# EAGLE schematic Tracker_V1 (EAGLE 9.6.2)
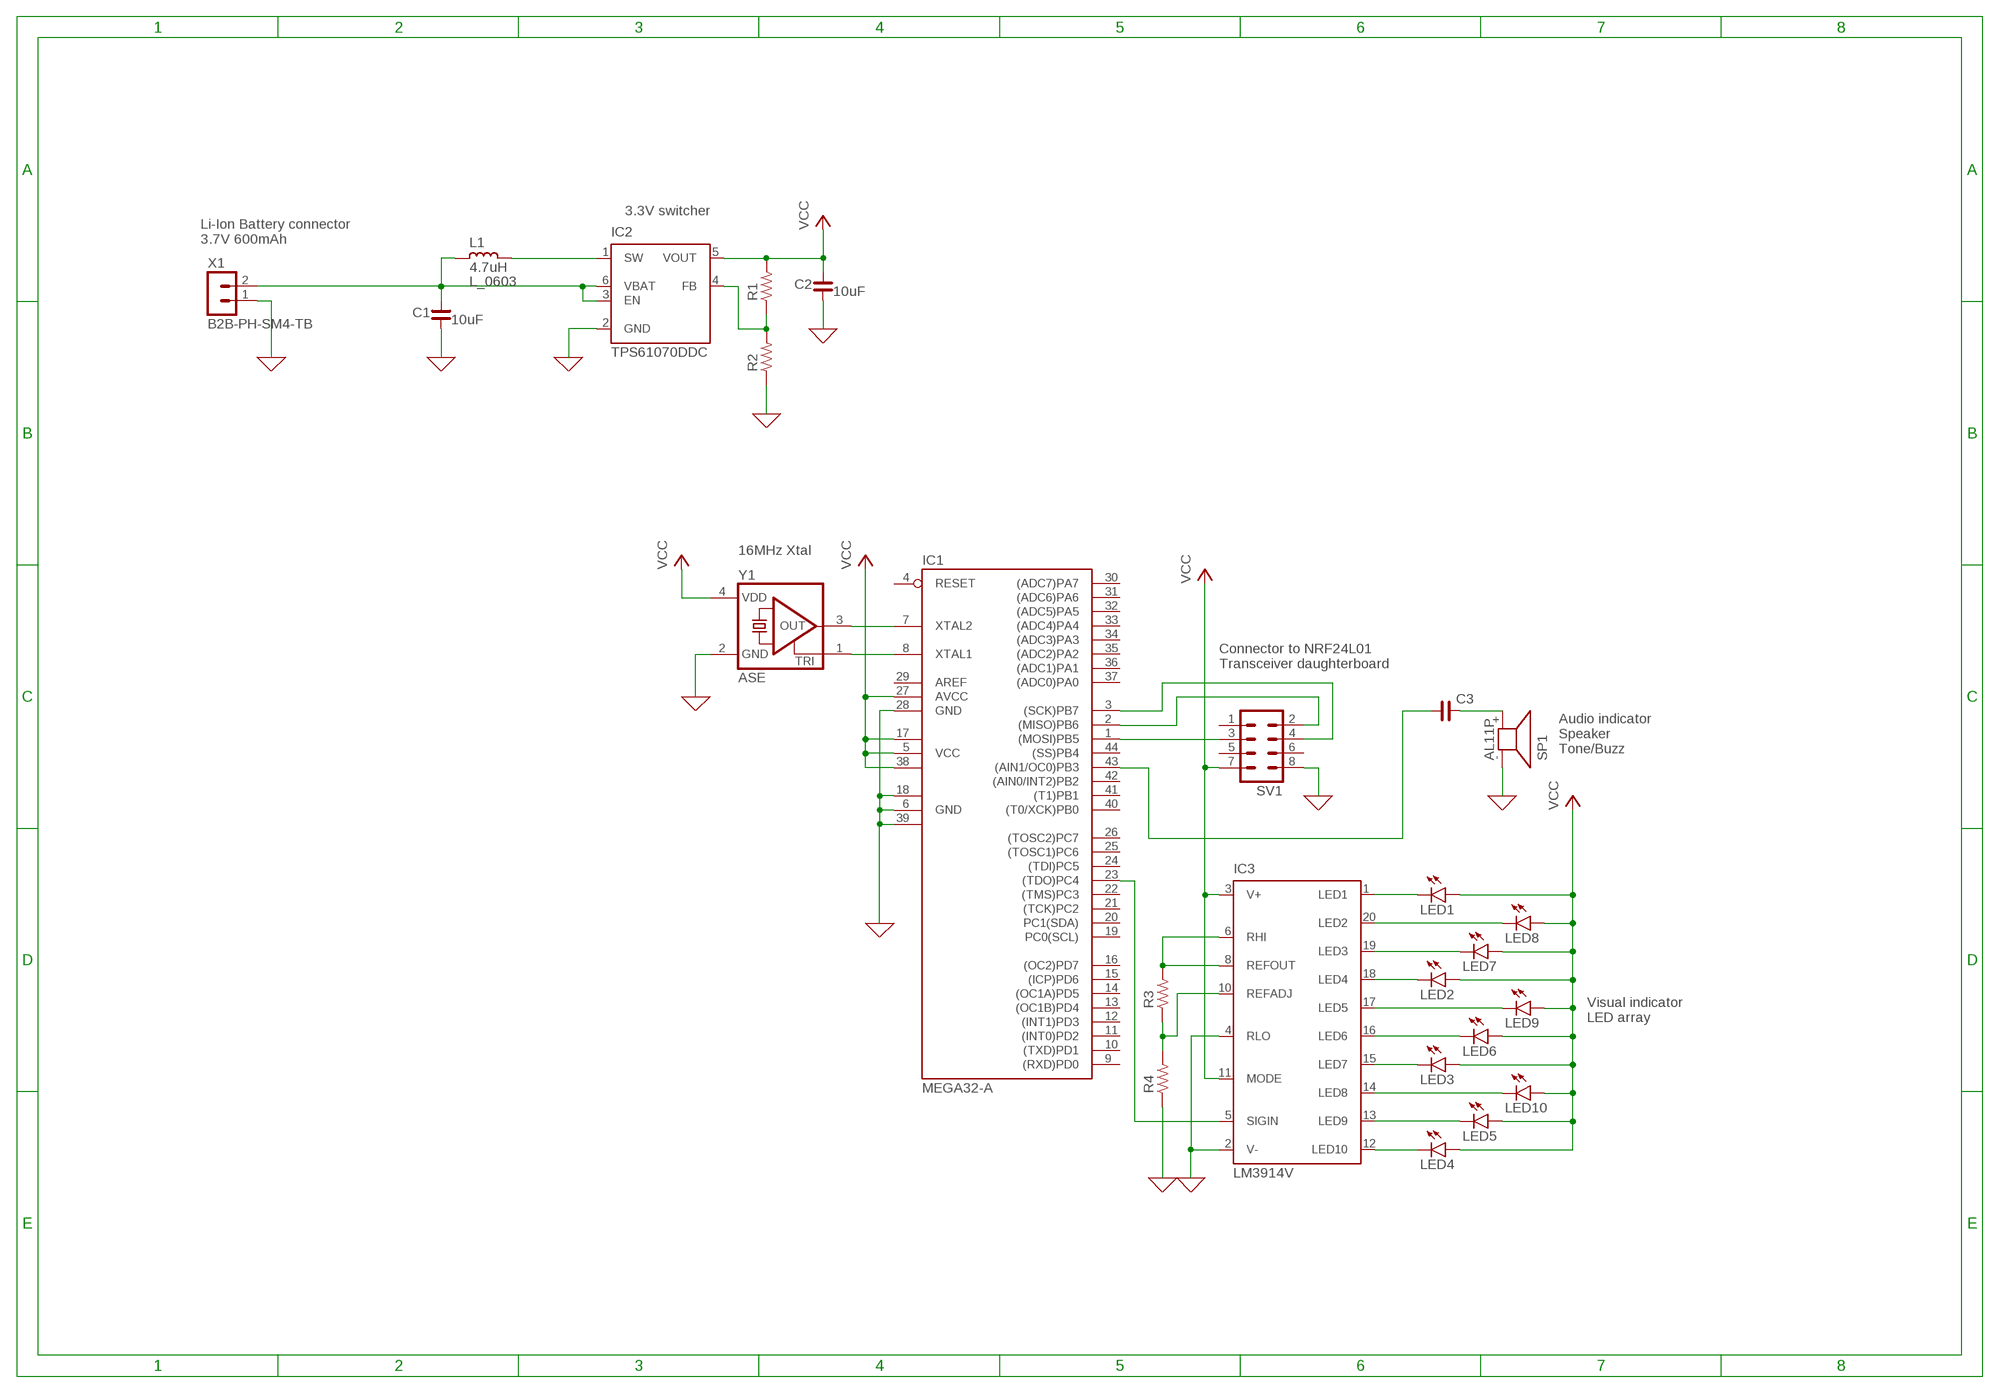
[diagram p0: schematic, sheet 1]

## Parts
C1  C_0603  [C0603]
C2  C_0603  [C0603]
C3  C_0603  [C0603]
IC1  MEGA32-A  [TQFP44]
IC2  TPS61070DDC  [TSOT23-6_DDC]
IC3  LM3914V  [PLCC20S]
L1  L_0603  [L0603]
LED1  LEDCHIP-LED0603  [CHIP-LED0603]
LED2  LEDCHIP-LED0603  [CHIP-LED0603]
LED3  LEDCHIP-LED0603  [CHIP-LED0603]
LED4  LEDCHIP-LED0603  [CHIP-LED0603]
LED5  LEDCHIP-LED0603  [CHIP-LED0603]
LED6  LEDCHIP-LED0603  [CHIP-LED0603]
LED7  LEDCHIP-LED0603  [CHIP-LED0603]
LED8  LEDCHIP-LED0603  [CHIP-LED0603]
LED9  LEDCHIP-LED0603  [CHIP-LED0603]
LED10  LEDCHIP-LED0603  [CHIP-LED0603]
R1  R_0603  [R0603]
R2  R_0603  [R0603]
R3  R_0603  [R0603]
R4  R_0603  [R0603]
SP1  AL11P  [AL11P]
SV1  MA04-2  [MA04-2]
X1  B2B-PH-SM4-TB  [B2B-PH-SM4-TB]
Y1  ASE  [ASE]

## Nets
0: C1.1 C2.1 IC1.6(GND) IC1.18(GND1) IC1.28(GND) IC1.39(GND2) IC2.2(GND) IC3.2(V-) IC3.4(RLO) R2.1 R4.1 SP1.- SV1.8 X1.1 Y1.2(GND) ; supply symbol labelled GND
N$1: IC2.1(SW) L1.1
N$2: C1.2 IC2.3(EN) IC2.6(VBAT) L1.2 X1.2
N$3: IC1.7(XTAL2) Y1.3(OUT)
N$4: IC1.8(XTAL1) Y1.1(TRI)
N$5: IC1.1((MOSI)PB5) SV1.3
N$6: IC2.4(FB) R1.1 R2.2
N$7: IC1.2((MISO)PB6) SV1.2
N$8: IC1.3((SCK)PB7) SV1.4
N$9: IC3.12(LED10) LED4.C
N$10: IC3.13(LED9) LED5.C
N$11: IC3.14(LED8) LED10.C
N$12: IC3.15(LED7) LED3.C
N$13: IC3.16(LED6) LED6.C
N$14: IC3.17(LED5) LED9.C
N$15: IC3.18(LED4) LED2.C
N$16: IC3.19(LED3) LED7.C
N$17: IC3.20(LED2) LED8.C
N$18: IC3.1(LED1) LED1.C
N$19: IC1.23((TDO)PC4) IC3.5(SIGIN)
N$20: IC3.6(RHI) IC3.8(REFOUT) R3.2
N$21: IC3.10(REFADJ) R3.1 R4.2
N$22: C3.1 IC1.43((AIN1/OC0)PB3)
N$23: C3.2 SP1.+
VCC: C2.2 IC1.5(VCC) IC1.17(VCC1) IC1.27(AVCC) IC1.38(VCC2) IC2.5(VOUT) IC3.3(V+) IC3.11(MODE) LED1.A LED2.A LED3.A LED4.A LED5.A LED6.A LED7.A LED8.A LED9.A LED10.A R1.2 SV1.7 Y1.4(VDD)
Unconnected: IC1.4(RESET) IC1.9((RXD)PD0) IC1.10((TXD)PD1) IC1.11((INT0)PD2) IC1.12((INT1)PD3) IC1.13((OC1B)PD4) IC1.14((OC1A)PD5) IC1.15((ICP)PD6) IC1.16((OC2)PD7) IC1.19(PC0(SCL)) IC1.20(PC1(SDA)) IC1.21((TCK)PC2) IC1.22((TMS)PC3) IC1.24((TDI)PC5) IC1.25((TOSC1)PC6) IC1.26((TOSC2)PC7) IC1.29(AREF) IC1.30((ADC7)PA7) IC1.31((ADC6)PA6) IC1.32((ADC5)PA5) IC1.33((ADC4)PA4) IC1.34((ADC3)PA3) IC1.35((ADC2)PA2) IC1.36((ADC1)PA1) IC1.37((ADC0)PA0) IC1.40((T0/XCK)PB0) IC1.41((T1)PB1) IC1.42((AIN0/INT2)PB2) IC1.44((SS)PB4) SV1.1 SV1.5 SV1.6

## Notes on the sheet
- 3.3V switcher
- Li-Ion Battery connector
  3.7V 600mAh
- 16MHz Xtal
- Connector to NRF24L01
  Transceiver daughterboard
- Audio indicator
  Speaker
  Tone/Buzz
- Visual indicator
  LED array

## Library data of the parts
C1 C2 = rc-master-smd:C_: NON-POLARIZED CAP; C1: 10uF
C3 = rc-master-smd:C_: NON-POLARIZED CAP
IC1 = atmel:MEGA32: MICROCONTROLLER 32 Kbytes FLASH 2 Kbytes SRAM 1 Kbytes EEPROM USART 8-channel 10 bit ADC Source: www.atmel.com .. doc2503.pdf; MPN: ATMEGA32-16AU; OC_FARNELL: 9171274; OC_NEWARK: 69K6677
IC2 = texas:TPS6107*: 90% EFFICIENT SYNCHRONOUS BOOST CONVERTER WITH 600-mA SWITCH Source: http://focus.ti.com/lit/ds/symlink/tps61070.pdf; MPN: TPS61070DDCR; OC_FARNELL: 1461062; OC_NEWARK: 64M3125
IC3 = national-semiconductor:LM391: Dot/Bar Display Driver Source: Data sheet LM3915 <http://www.national.com/ds/LM/LM3915.pdf> Data sheet LM3914 <http://www.national.com/ds/LM/LM3914.pdf>
L1 = rc-master-smd:L_: INDUCTOR; L1: 4.7uH
LED1-LED10 = led:LED: LED OSRAM: - CHIPLED LG R971, LG N971, LY N971, LG Q971, LY Q971, LO R971, LY R971 LH N974, LH R974 LS Q976, LO Q976, LY Q976 LO Q996 - Hyper CHIPLED LW Q18S LB Q993, LB Q99A, LB R99A - SideLED LS A670, LO A670, LY A670, LG A670, LP A670 LB A673, LV A673, LT A673, LW A673 LH A674 LY A675 LS A676, LA A676, LO A676, LY A676, LW A676 LS A679, LY A679, LG A679 - Hyper Micro SIDELED® LS Y876, LA Y876, LO Y876, LY Y876 LT Y87S - SmartLED LW L88C, LW L88S LB L89C, LB L89S, LG L890 LS L89K, LO L89K, LY L89K LS L896, LA L896, LO L896, LY L896 - TOPLED LS T670, LO T670, LY T670, LG T670, LP T670 LSG T670, LSP T670, LSY T670, LOP T670, LYG T670 LG T671, LOG T671, LSG T671 LB T673, LV T673, LT T673, LW T673 LH T674 LS T676, LA T676, LO T676, LY T676, LB T676, LH T676, LSB T676, LW T676 LB T67C, LV T67C, LT T67C, LS T67K, LO T67K, LY T67K, LW E67C LS E67B, LA E67B, LO E67B, LY E67B, LB E67C, LV E67C, LT E67C LW T67C LS T679, LY T679, LG T679 LS T770, LO T770, LY T770, LG T770, LP T770 LB T773, LV T773, LT T773, LW T773 LH T774 LS E675, LA E675, LY E675, LS T675 LS T776, LA T776, LO T776, LY T776, LB T776 LHGB T686 LT T68C, LB T68C - Hyper Mini TOPLED® LB M676 - Mini TOPLED Santana® LG M470 LS M47K, LO M47K, LY M47K Source: http://www.osram.convergy.de LUXEON: - LUMILED® LXK2-PW12-R00, LXK2-PW12-S00, LXK2-PW14-U00, LXK2-PW14-V00 LXK2-PM12-R00, LXK2-PM12-S00, LXK2-PM14-U00 LXK2-PE12-Q00, LXK2-PE12-R00, LXK2-PE12-S00, LXK2-PE14-T00, LXK2-PE14-U00 LXK2-PB12-K00, LXK2-PB12-L00, LXK2-PB12-M00, LXK2-PB14-N00, LXK2-PB14-P00, LXK2-PB14-Q00 LXK2-PR12-L00, LXK2-PR12-M00, LXK2-PR14-Q00, LXK2-PR14-R00 LXK2-PD12-Q00, LXK2-PD12-R00, LXK2-PD12-S00 LXK2-PH12-R00, LXK2-PH12-S00 LXK2-PL12-P00, LXK2-PL12-Q00, LXK2-PL12-R00 Source: www.luxeon.com KINGBRIGHT: KA-3528ASYC Source: www.kingbright.com
R1-R4 = rc-master-smd:R_: RESISTOR
SP1 = buzzer:AL11P: SPEAKER Source: Buerklin; OC_FARNELL: unknown; OC_NEWARK: unknown
SV1 = con-lstb:MA04-2: PIN HEADER; OC_FARNELL: unknown; OC_NEWARK: unknown
X1 = con-JST PH:B2B-PH: JST PH series header 2.00mm pitch disconnectable crimp style connectors, vertical (side entry type), 2 pins
Y1 = crystal:ASE: 3.3Vdc CMOS SMD CRYSTAL CLOCK OSCILLATOR SOurce: www.abracon.com; OC_FARNELL: unknown; OC_NEWARK: unknown